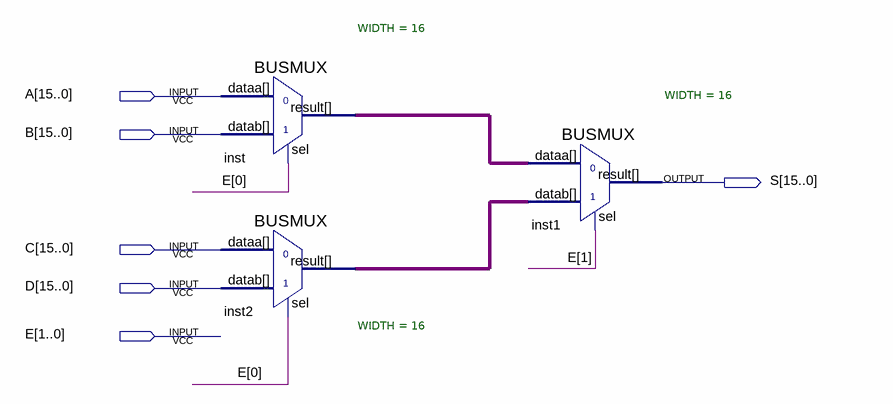
[diagram p0: schematic sheet]
// Quartus schematic mux4.bdf as structural Verilog: 3 symbols, 6 pins
module mux4 (
  input  [15:0] A,
  input  [15:0] B,
  input  [15:0] C,
  input  [15:0] D,
  input  [1:0] E,
  output [15:0] S
);

  wire [15:0] inst2_result, inst_result;

  BUSMUX #(.WIDTH(16)) inst (.datab(B), .sel(E[0]), .dataa(A), .result(inst_result));
  BUSMUX #(.WIDTH(16)) inst2 (.datab(D), .sel(E[0]), .dataa(C), .result(inst2_result));
  BUSMUX #(.WIDTH(16)) inst1 (.datab(inst2_result), .sel(E[1]), .dataa(inst_result), .result(S));
endmodule
